# EasyEDA schematic Arduino UNO HuHu tecnologies.json
TITLE: Sheet_1; REV: 1.0; Date: 2023-11-19; Sheet: 1/1; Company: Your Company
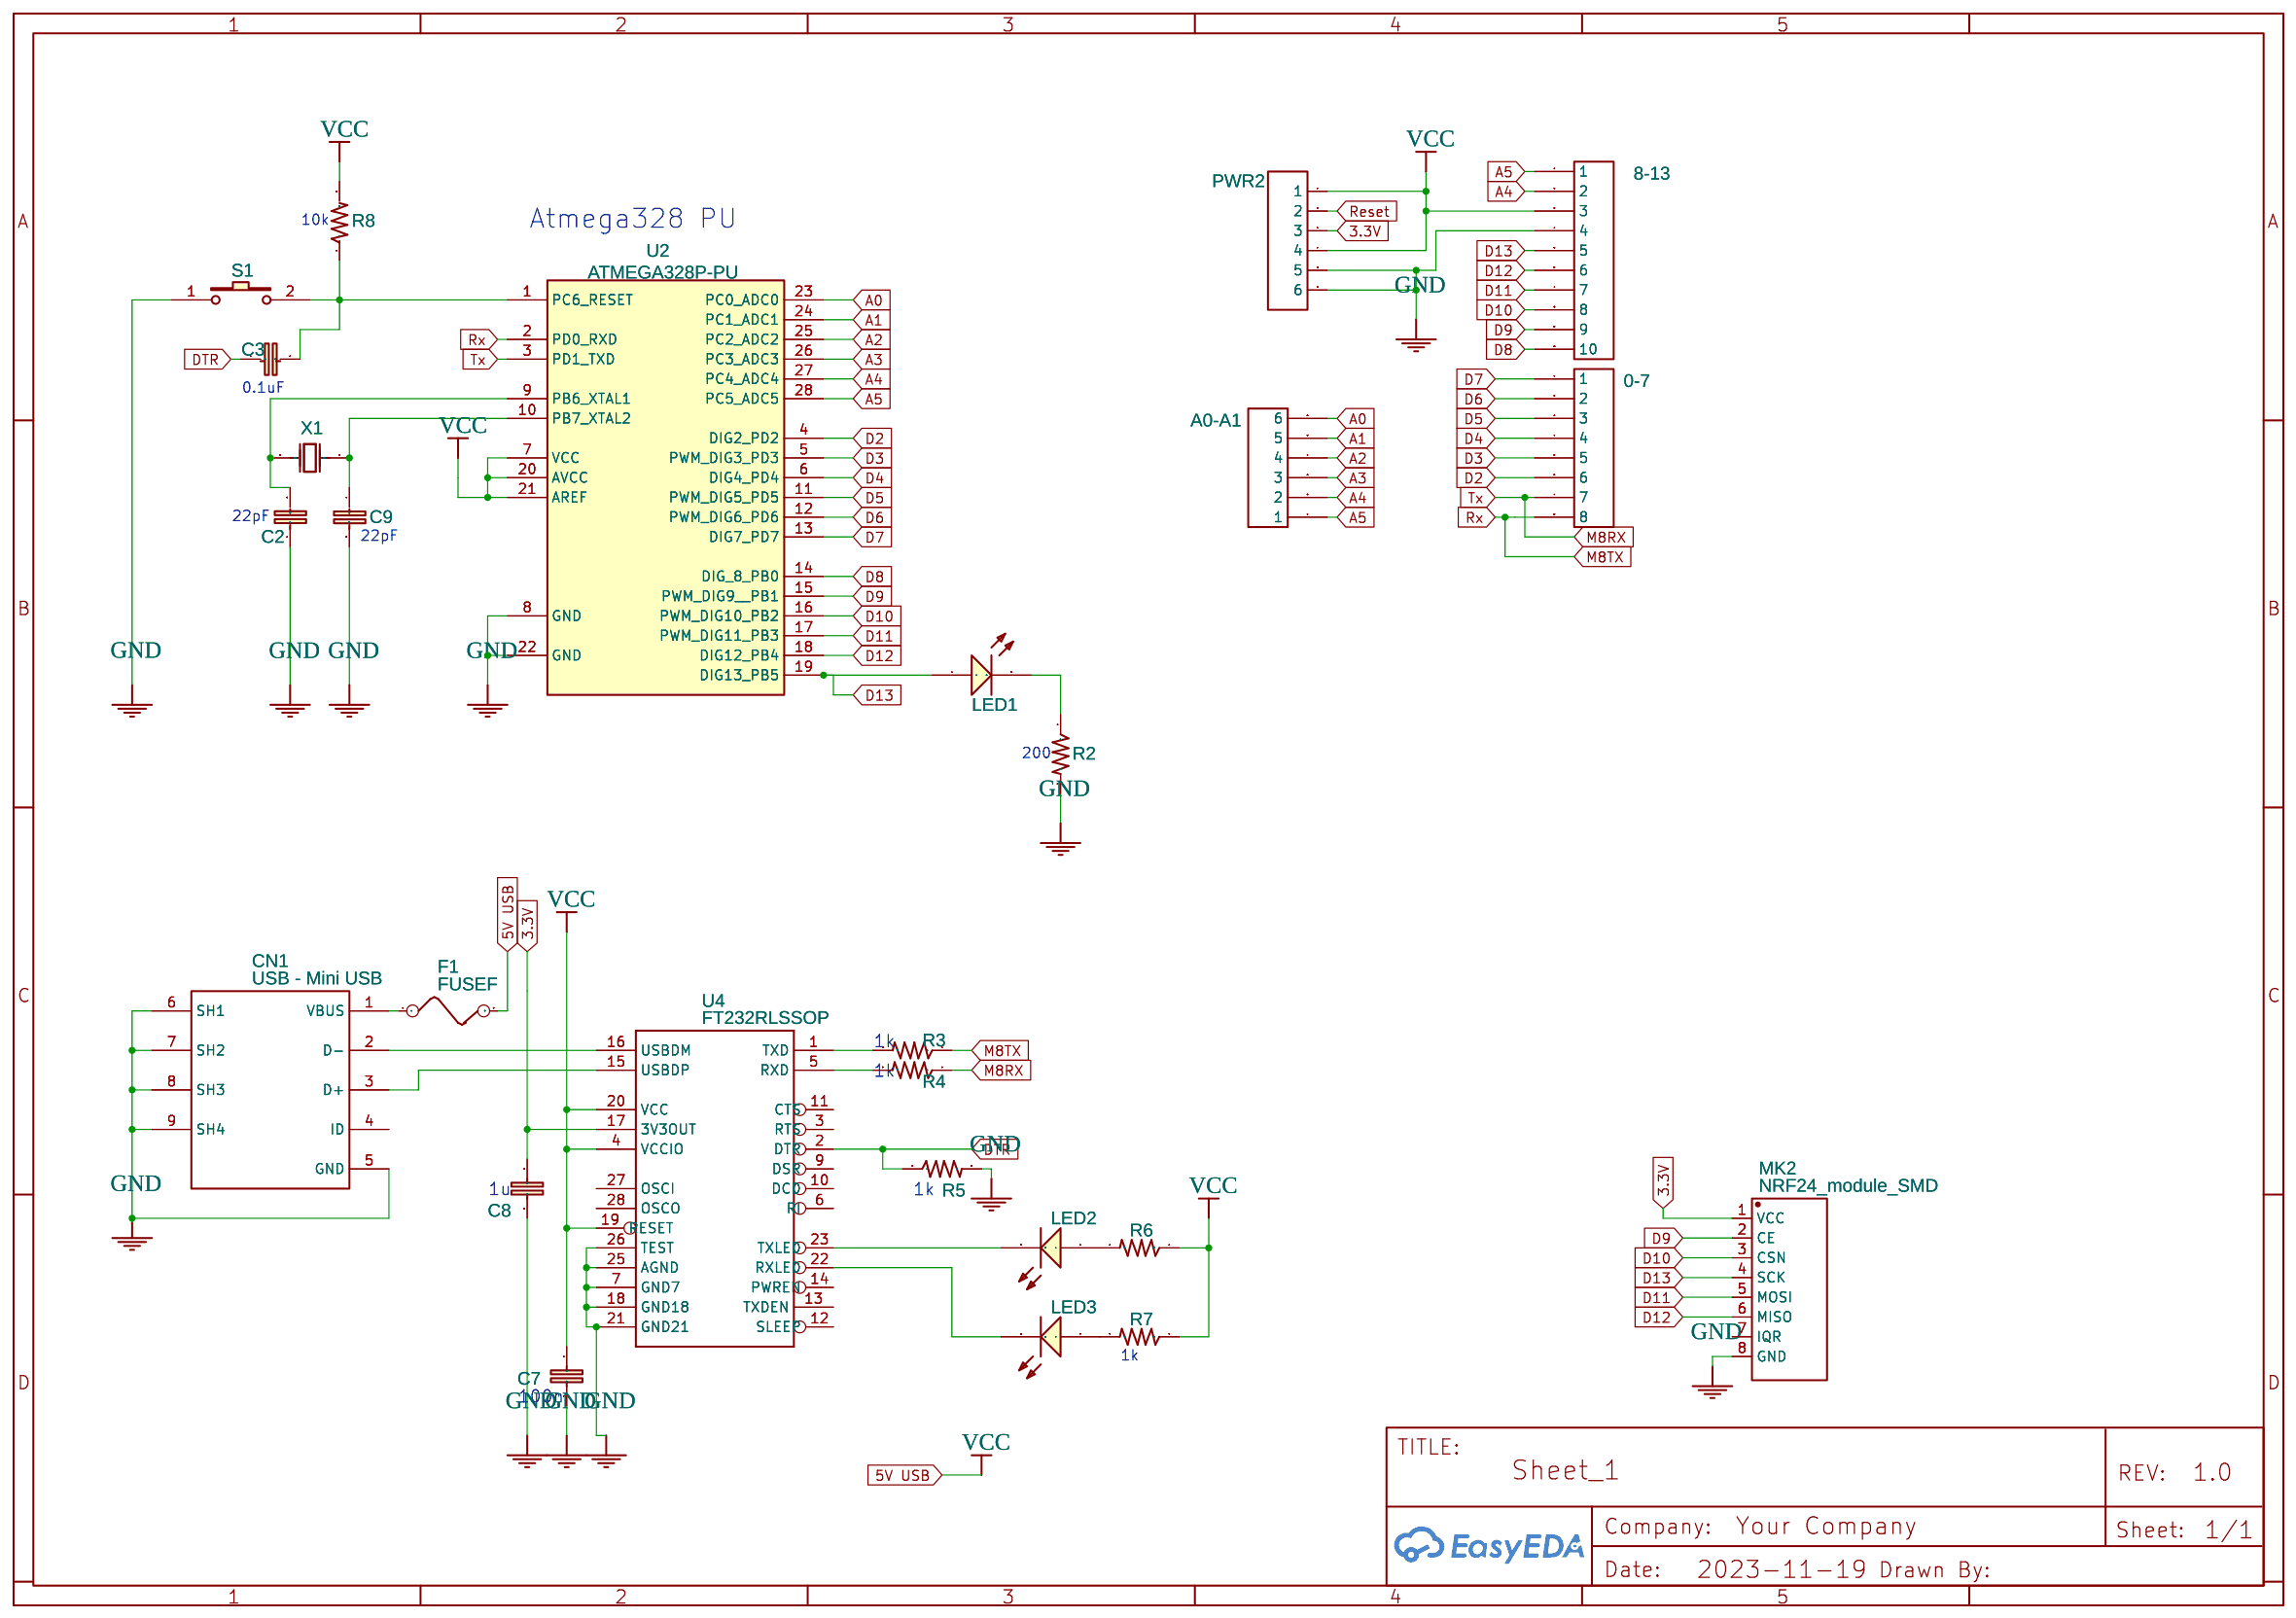
[diagram p0: schematic sheet]

## Parts
0-7  0-7  [HDR-8X1/2.54]
8-13  8-Aref  [HDR-10X1/2.54]
A0-A1  Analogs  [HDR-6X1/2.54]
C2  CAPACITOR_NPOL-0805  [C805]
C3  CAPACITOR_NPOL-0805  [C805]
C7  CAPACITOR_NPOL-0805  [C805]
C8  CAPACITOR_NPOL-0805  [C805]
C9  CAPACITOR_NPOL-0805  [C805]
CN1  USB - Mini USB  [MINI USB]
F1  FUSEF  [1812]
LED1  17-21/GHC-YR1S2/3T  [LED-0805]
LED2  17-21/GHC-YR1S2/3T  [LED-0805]
LED3  17-21/GHC-YR1S2/3T  [LED-0805]
MK2  NRF24_module_SMD  [NRF2_MODULE_SMD_PCB]
PWR2  Power  [HDR-F-2.54_1X6]
R2  200  [0805]
R3  200  [0805]
R4  200  [0805]
R5  200  [0805]
R6  200  [0805]
R7  200  [0805]
R8  0.22OHM-1_4W-1%(0805)  [0805]
S1  Button1  [SMD PUSH BUTTON]
U2  ATMEGA328P-PU  [DIP-28_300MIL]
U4  FT232RLSSOP  [SSOP28DB]
X1  16MHZ  [OSC-49S-1]

## Library data of the parts
0-7 = -: Supplier: LCSC; Manufacturer: ReliaPro; Manufacturer Part: Header2.54mm 1*8P; image: http://image.lceda.cn/szlcsc/C49256.jpg
8-13 = -: Supplier: LCSC; Manufacturer: ReliaPro; Manufacturer Part: Headers  Pins2.54mm1*10P; image: http://image.lceda.cn/szlcsc/C57369.jpg
A0-A1 = -: Supplier: LCSC; Manufacturer: BOOMELE; Manufacturer Part: Header-Male-2.54_1x6; Supplier Part: C37208
C2 C7-C9 = -: Non-Polarized capacitor in various packages; catid: 20; Contributor: DangerousPrototype; Manufacturer Part: ?
C3 = -: Non-Polarized capacitor in various packages; catid: 20; Contributor: DangerousPrototype; Manufacturer Part: ?; Package Display: No
CN1 = -: link: https://www.es.co.th/Schemetic/PDF/MUMRB05FTKN.PDF; Contributor: suwanp
F1 = -: Manufacturer Part: ?
LED1-LED3 = -: Supplier: EasyEDA; Manufacturer: EVERLIGHT; Supplier Part: E73546
MK2 = -: Supplier: LCSC; Manufacturer: Ashining; Manufacturer Part: AS01-ML01S; Supplier Part: C84802
PWR2 = HDR-F-2.54_1x6: Supplier Part: C40877; Supplier: LCSC; Contributor: LCEDA_Lib
R2-R8 = -: RES-09883; catid: 20; Contributor: SparkFun; Manufacturer Part: ?
S1 = -: catid: 20; sourceId: K60iAuM3l; Manufacturer Part: ?
U2 = -: catid: 20; sourceId: Oic6oiASL; Supplier: LCSC; Manufacturer: ATMEL; Supplier Part: C33901
U4 = -: USB UART; Contributor: SparkFun; Manufacturer Part: ?
X1 = -: Supplier: LCSC; Manufacturer: YXC; Manufacturer Part: X49SD16MSD2SC; Supplier Part: C16212

## Nets
3.3V: C8.1 MK2.1(VCC) PWR2.3 U4.17(3V3OUT)
5V USB: 8-13.3 C7.1 F1.2 PWR2.1 PWR2.4 R6.1 R7.1 R8.2 U2.7(VCC) U2.20(AVCC) U2.21(AREF) U4.4(VCCIO) U4.19(RESET) U4.20(VCC)
GND: 8-13.4 C2.1 C7.2 C8.2 C9.2 CN1.5(GND) CN1.6(SH1) CN1.7(SH2) CN1.8(SH3) CN1.9(SH4) MK2.8(GND) PWR2.5 PWR2.6 R2.2 R5.2 S1.1 U2.8(GND) U2.22(GND) U4.7(GND7) U4.18(GND18) U4.21(GND21) U4.25(AGND) U4.26(TEST)
A0: A0-A1.6 U2.23(PC0 ADC0)
A1: A0-A1.5 U2.24(PC1 ADC1)
A2: A0-A1.4 U2.25(PC2 ADC2)
A3: A0-A1.3 U2.26(PC3 ADC3)
A4: 8-13.2 A0-A1.2 U2.27(PC4 ADC4)
A5: 8-13.1 A0-A1.1 U2.28(PC5 ADC5)
D2: 0-7.6 U2.4(DIG2 PD2)
D3: 0-7.5 U2.5(PWM DIG3 PD3)
D4: 0-7.4 U2.6(DIG4 PD4)
D5: 0-7.3 U2.11(PWM DIG5 PD5)
D6: 0-7.2 U2.12(PWM DIG6 PD6)
D7: 0-7.1 U2.13(DIG7 PD7)
D8: 8-13.10 U2.14(DIG 8 PB0)
D9: 8-13.9 MK2.2(CE) U2.15(PWM DIG9  PB1)
D10: 8-13.8 MK2.3(CSN) U2.16(PWM DIG10 PB2)
D11: 8-13.7 MK2.5(MOSI) U2.17(PWM DIG11 PB3)
D12: 8-13.6 MK2.6(MISO) U2.18(DIG12 PB4)
D13: 8-13.5 LED1.1(A) MK2.4(SCK) U2.19(DIG13 PB5)
DTR: C3.1 R5.1 U4.2(DTR)
M8RX: 0-7.7 R4.1 U2.3(PD1 TXD)
M8TX: 0-7.8 R3.1 U2.2(PD0 RXD)
Reset: PWR2.2
Net-(C2-2): C2.2 U2.9(PB6 XTAL1) X1.2(OSC2)
Net-(C3-2): C3.2 R8.1 S1.2 U2.1(PC6 RESET)
Net-(C9-1): C9.1 U2.10(PB7 XTAL2) X1.1(OSC1)
Net-(CN1-1): CN1.1(VBUS) F1.1
Net-(CN1-2): CN1.2(D-) U4.16(USBDM)
Net-(CN1-3): CN1.3(D+) U4.15(USBDP)
Net-(LED1-2): LED1.2(C) R2.1
Net-(LED2-1): LED2.1(A) R6.2
Net-(LED2-2): LED2.2(C) U4.23(TXLED)
Net-(LED3-1): LED3.1(A) R7.2
Net-(LED3-2): LED3.2(C) U4.22(RXLED)
Net-(R3-2): R3.2 U4.1(TXD)
Net-(R4-2): R4.2 U4.5(RXD)

Not connected (* = marked no-connect by the designer): CN1 4(ID); MK2 7(IQR); U4 3(RTS) 6(RI) 9(DSR) 10(DCD) 11(CTS) 12(SLEEP) 13(TXDEN) 14(PWREN) 27(OSCI) 28(OSCO)

## Notes on the sheet
- Atmega328 PU
- 10k
- 0.1uF
- 22pF
- 22pF
- 200
- 1k
- 1k
- 1u
- 1k
- 1k
- 100n
